# EAGLE design pc_heartypatch (EAGLE 6.4)
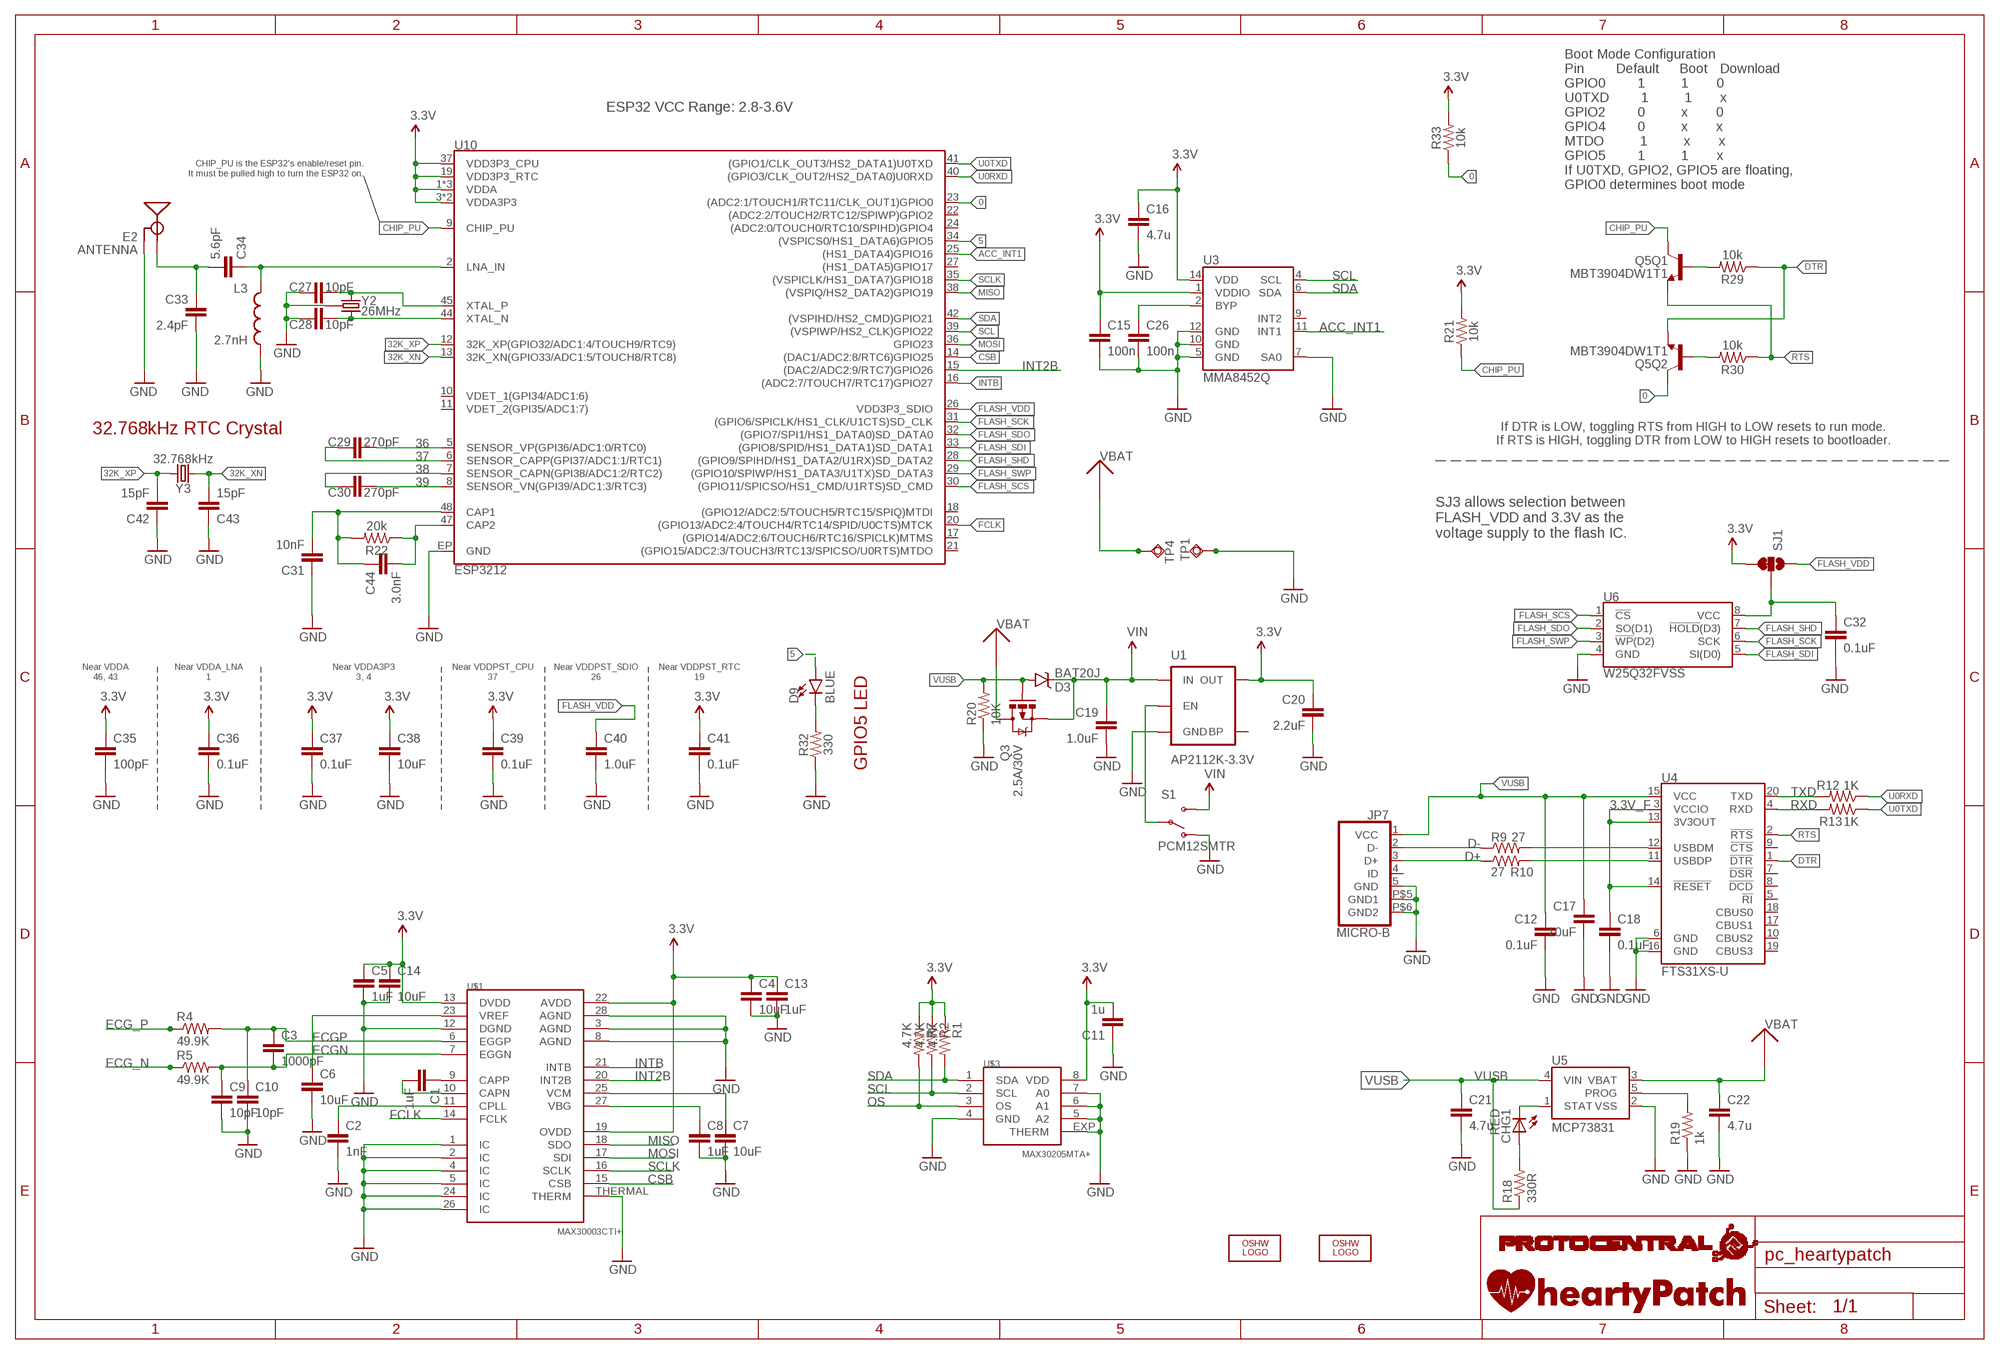
[diagram p0: schematic, sheet 1]

## Parts
C1  1uF  C-EUC0603  [C0603]
C2  1nF  C-EUC0603  [C0603]
C3  1000pF  C-EUC0402  [C0402]
C4  10uF  C-EUC0805  [C0805]
C5  1uF  C-EUC0402  [C0402]
C6  10uF  C-EUC0805  [C0805]
C7  10uF  C-EUC0805  [C0805]
C8  1uF  C-EUC0805  [C0805]
C9  10pF  C-EUC0402  [C0402]
C10  10pF  C-EUC0402  [C0402]
C11  1u  C-EUC0805  [C0805]
C12  0.1uF  C-EUC0402  [C0402]
C13  1uF  C-EUC0805  [C0805]
C14  10uF  C-EUC0603  [C0603]
C15  100n  C-EUC0402  [C0402]
C16  4.7u  C-EUC0805  [C0805]
C17  10uF  C-EUC0805  [C0805]
C18  0.1uF  C-EUC0402  [C0402]
C19  1.0uF  C-EUC0402  [C0402]
C20  2.2uF  2.2UF-10V-20%(0603)  [0603-CAP@1]
C21  4.7u  C-EUC0805  [C0805]
C22  4.7u  C-EUC0805  [C0805]
C26  100n  C-EUC0402  [C0402]
C27  10pF  10PF-0603-50V-5%  [0603]
C28  10pF  10PF-0603-50V-5%  [0603]
C29  270pF  270PF-50V-5%(0603)  [0603]
C30  270pF  270PF-50V-5%(0603)  [0603]
C31  10nF  10NF-0603-50V-10%  [0603]
C32  0.1uF  0.1UF-0402-16V-10%  [0402]
C33  2.4pF  2.4PF-0603-50V-5%  [0603]
C34  5.6pF  5.6PF-50V-5%(0603)  [0603]
C35  100pF  100PF-0603-50V-5%  [0603]
C36  0.1uF  0.1UF-0603-25V-(+80/-20%)  [0603]
C37  0.1uF  0.1UF-0603-25V-(+80/-20%)  [0603]
C38  10uF  10UF-0603-6.3V-20%  [0603]
C39  0.1uF  0.1UF-0402-16V-10%  [0402]
C40  1.0uF  1.0UF-0603-16V-10%  [0603]
C41  0.1uF  0.1UF-0603-25V-(+80/-20%)  [0603]
C42  15pF  15PF-0603-50V-5%  [0603]
C43  15pF  15PF-0603-50V-5%  [0603]
C44  3.0nF  3.0NF-0603-50V-5%  [0603]
CHG1  RED  LEDCHIPLED_0603  [CHIPLED_0603]
D3  BAT20J  DIODE-SCHOTTKY-BAT20J  [SOD-323]
D9  BLUE  LED-BLUE0603  [LED-0603]
E2  ANTENNA  ANTENNATRACE-TUNED  [TRACE_ANTENNA_2.4GHZ_25.7MM_TUNED]
JP7  MICRO-B  [MICRO-B]
L3  2.7nH  INDUCTOR0603  [0603]
LOGO1  OSHW_LOGO_FILLX0200-NT  [OSHW_FILLX200_NOTEXT]
LOGO2  OSHW_LOGO_FILLX0200-NT  [OSHW_FILLX200_NOTEXT]
Q3  2.5A/30V  MOSFET-PCHANNELDMG2307L  [SOT23-3]
Q5  MBT3904DW1T1  [SC70-6]
R1  4.7K  R-US_R0402  [R0402]
R2  4.7K  R-US_R0402  [R0402]
R4  49.9K  RESISTOR0805-RES  [0805]
R5  49.9K  RESISTOR0805-RES  [0805]
R7  4.7K  R-US_R0402  [R0402]
R9  27  R-US_R0402  [R0402]
R10  27  R-US_R0402  [R0402]
R12  1K  R-US_R0402  [R0402]
R13  1K  R-US_R0402  [R0402]
R18  330R  R-US_R0402  [R0402]
R19  1k  R-US_R0402  [R0402]
R20  10K  R-US_R0402  [R0402]
R21  10k  10KOHM-1/10W-1%(0603)0603  [0603]
R22  20k  20KOHM-0603-1/10W-1%  [0603]
R29  10k  10KOHM-0603-1/10W-1%  [0603]
R30  10k  10KOHM-0603-1/10W-1%  [0603]
R32  330  330OHM1/10W1%(0603)  [0603]
R33  10k  10KOHM-1/10W-1%(0603)0603  [0603]
S1  PCM12SMTR  SWITCH-SPDT-SMD-A  [SWITCH-SPST-SMD-A]
SJ1  JUMPER-PAD-3-2OF3_NC_BY_TRACE_SMALL  [PAD-JUMPER-3-2OF3_NC_BY_TRACE_YES_SILK_FULL_BOX]
TP1  TPSQTP20SQ  [TP20SQ]
TP4  TPSQTP20SQ  [TP20SQ]
U1  AP2112K-3.3V  V_REG_LDOSMD  [SOT23-5]
U3  MMA8452Q  [QFN-16_0.5MM]
U4  FTS31XS-U  FT231XS  [SSOP20_L]
U5  MCP73831  [SOT23-5]
U6  W25Q32FVSS  [SOIC-8]
U10  ESP3212  [QFN48-0.4MM]
U$1  MAX30003CTI+  MAX30003  [QFN-28]
U$3  MAX30205MTA+  [TDFN-08]
U$8  HEARTYPATCHHEART  [HEARTYPATCH]
U$9  PROTY_LOGO_WITH_TEXT  [PROTY_WITH_TEXT]
Y2  26MHz  CRYSTAL-GROUNDED3.2X2.5  [CRYSTAL-SMD-3.2X2.5]
Y3  32.768kHz  CRYSTAL-32.768KHZSMD-3.2X1.5  [CRYSTAL-SMD-3.2X1.5MM]

## Nets
0: Q5.6(Q2:C) R33.1 U10.23((ADC2:1/TOUCH1/RTC11/CLK_OUT1)GPIO0)
3.3V: C4.1 C5.1 C11.2 C13.1 C14.1 C15.1 C16.1 C20.1 C35.1 C36.1 C37.1 C38.1 C39.1 C41.1 R1.1 R2.1 R7.1 R21.2 R33.2 SJ1.3 U1.5(OUT) U3.1(VDDIO) U3.14(VDD) U10.1(VDDA) U10.3(VDDA3P3) U10.4(VDDA3P3) U10.19(VDD3P3_RTC) U10.37(VDD3P3_CPU) U10.43(VDDA) U10.46(VDDA) U$1.13(DVDD) U$1.19(OVDD) U$1.22(AVDD) U$3.8(VDD)
3.3V_F: C18.1 U4.3(VCCIO) U4.13(3V3OUT) U4.14(!RESET)
5: D9.A U10.34((VSPICS0/HS1_DATA6)GPIO5)
32K_XN: C43.2 U10.13(32K_XN(GPIO33/ADC1:5/TOUCH8/RTC8)) Y3.P$2
32K_XP: C42.2 U10.12(32K_XP(GPIO32/ADC1:4/TOUCH9/RTC9)) Y3.P$1
36: C29.2 U10.5(SENSOR_VP(GPI36/ADC1:0/RTC0))
37: C29.1 U10.6(SENSOR_CAPP(GPI37/ADC1:1/RTC1))
38: C30.1 U10.7(SENSOR_CAPN(GPI38/ADC1:2/RTC2))
39: C30.2 U10.8(SENSOR_VN(GPI39/ADC1:3/RTC3))
ACC_INT1: U3.11(INT1) U10.25((HS1_DATA4)GPIO16)
CAP_10N: C31.2 C44.1 R22.2 U10.48(CAP1)
CHIP_PU: Q5.3(Q1:C) R21.1 U10.9(CHIP_PU)
CSB: U10.14((DAC1/ADC2:8/RTC6)GPIO25) U$1.15(CSB)
D+: JP7.3(D+) R10.1
D-: JP7.2(D-) R9.1
DTR: Q5.1(Q2:E) R29.1 U4.1(!DTR)
ECG_N: R5.1
ECG_P: R4.1
ECGN: C3.2 C9.1 R5.2 U$1.7(EGGN)
ECGP: C3.1 C10.1 R4.2 U$1.6(EGGP)
FCLK: U10.20((GPIO13/ADC2:4/TOUCH4/RTC14/SPID/U0CTS)MTCK) U$1.14(FCLK)
FLASH_SCK: U6.6(SCK) U10.31((GPIO6/SPICLK/HS1_CLK/U1CTS)SD_CLK)
FLASH_SCS: U6.1(!CS!) U10.30((GPIO11/SPICSO/HS1_CMD/U1RTS)SD_CMD)
FLASH_SDI: U6.5(SI(D0)) U10.33((GPIO8/SPID/HS1_DATA1)SD_DATA1)
FLASH_SDO: U6.2(SO(D1)) U10.32((GPIO7/SPI1/HS1_DATA0)SD_DATA0)
FLASH_SHD: U6.7(!HOLD!(D3)) U10.28((GPIO9/SPIHD/HS1_DATA2/U1RX)SD_DATA2)
FLASH_SWP: U6.3(!WP!(D2)) U10.29((GPIO10/SPIWP/HS1_DATA3/U1TX)SD_DATA3)
FLASH_VDD: C40.1 SJ1.1 U10.26(VDD3P3_SDIO)
GND: C2.2 C4.2 C5.2 C6.2 C7.2 C8.2 C9.2 C10.2 C11.1 C12.2 C13.2 C14.2 C15.2 C16.2 C17.2 C18.2 C19.2 C20.2 C21.2 C22.2 C26.2 C27.1 C28.1 C31.1 C32.2 C33.2 C35.2 C36.2 C37.2 C38.2 C39.2 C40.2 C41.2 C42.1 C43.1 E2.GND E2.GND2(GND) JP7.5(GND) JP7.P$5(GND1) JP7.P$6(GND2) L3.2 R19.1 R20.1 R32.1 S1.1(O) TP1.TP U1.2(GND) U3.5(GND) U3.7(SA0) U3.10(GND) U3.12(GND) U4.6(GND) U4.16(GND) U5.2(VSS) U6.4(GND) U10.EP(GND) U$1.1(IC) U$1.2(IC) U$1.3(AGND) U$1.4(IC) U$1.5(IC) U$1.8(AGND) U$1.12(DGND) U$1.24(IC) U$1.26(IC) U$1.28(AGND) U$1.THERMAL(THERM) U$3.4(GND) U$3.5(A2) U$3.6(A1) U$3.7(A0) U$3.EXP(THERM) Y2.2(GND) Y2.4(GND)
INT2B: U10.15((DAC2/ADC2:9/RTC7)GPIO26) U$1.20(INT2B)
INTB: U10.16((ADC2:7/TOUCH7/RTC17)GPIO27) U$1.21(INTB)
LNA_IN: C34.1 L3.1 U10.2(LNA_IN)
MISO: U10.38((VSPIQ/HS2_DATA2)GPIO19) U$1.18(SDO)
MOSI: U10.36(GPIO23) U$1.17(SDI)
N$2: C6.1 U$1.23(VREF)
N$3: C1.1 U$1.9(CAPP)
N$4: C26.1 U3.2(BYP)
N$5: CHG1.C U5.1(STAT)
N$6: C1.2 U$1.10(CAPN)
N$7: C2.1 U$1.11(CPLL)
N$9: R9.2 U4.12(USBDM)
N$11: R10.2 U4.11(USBDP)
N$13: C7.1 U$1.25(VCM)
N$14: C8.1 U$1.27(VBG)
N$15: S1.2(P) U1.3(EN)
N$16: CHG1.A R18.2
N$19: R19.2 U5.5(PROG)
N$20: C32.1 SJ1.2 U6.8(VCC)
N$23: Q5.5(Q1:B) R29.2
N$24: Q5.2(Q2:B) R30.2
N$25: C27.2 U10.45(XTAL_P) Y2.1
N$26: C28.2 U10.44(XTAL_N) Y2.3
N$29: D9.C R32.2
N$30: C44.2 R22.1 U10.47(CAP2)
OS: R7.2 U$3.3(OS)
RTS: Q5.4(Q1:E) R30.1 U4.2(!RTS)
RXD: R13.2 U4.4(RXD)
SCL: R2.2 U3.4(SCL) U10.39((VSPIWP/HS2_CLK)GPIO22) U$3.2(SCL)
SCLK: U10.35((VSPICLK/HS1_DATA7)GPIO18) U$1.16(SCLK)
SDA: R1.2 U3.6(SDA) U10.42((VSPIHD/HS2_CMD)GPIO21) U$3.1(SDA)
TRACE_ANT1: C33.1 C34.2 E2.ANT(SIGNAL)
TXD: R12.2 U4.20(TXD)
U0RXD: R12.1 U10.40((GPIO3/CLK_OUT2/HS2_DATA0)U0RXD)
U0TXD: R13.1 U10.41((GPIO1/CLK_OUT3/HS2_DATA1)U0TXD)
VBAT: C22.1 Q3.3(D) TP4.TP U5.3(VBAT)
VIN: C19.1 D3.C Q3.2(S) S1.3(S) U1.1(IN)
VUSB: C12.1 C17.1 C21.1 D3.A JP7.1(VCC) Q3.1(G) R18.1 R20.2 U4.15(VCC) U5.4(VIN)
Unconnected: JP7.4(ID) U1.4(BP) U3.9(INT2) U4.5(!RI) U4.7(!DSR) U4.8(!DCD) U4.9(!CTS) U4.10(CBUS2) U4.17(CBUS1) U4.18(CBUS0) U4.19(CBUS3) U10.10(VDET_1(GPI34/ADC1:6)) U10.11(VDET_2(GPI35/ADC1:7)) U10.17((GPIO14/ADC2:6/TOUCH6/RTC16/SPICLK)MTMS) U10.18((GPIO12/ADC2:5/TOUCH5/RTC15/SPIQ)MTDI) U10.21((GPIO15/ADC2:3/TOUCH3/RTC13/SPICSO/U0RTS)MTDO) U10.22((ADC2:2/TOUCH2/RTC12/SPIWP)GPIO2) U10.24((ADC2:0/TOUCH0/RTC10/SPIHD)GPIO4) U10.27((HS1_DATA5)GPIO17)

## Notes on the sheet
- ESP32 VCC Range: 2.8-3.6V
- CHIP_PU is the ESP32's enable/reset pin.
  It must be pulled high to turn the ESP32 on.
- Boot Mode Configuration
  Pin        Default     Boot   Download
  GPIO0        1         1       0
  U0TXD        1         1       x
  GPIO2        0         x       0
  GPIO4        0         x       x
  MTDO         1         x       x
  GPIO5        1         1       x
  If U0TXD, GPIO2, GPIO5 are floating, 
  GPIO0 determines boot mode
- 32.768kHz RTC Crystal
- If DTR is LOW, toggling RTS from HIGH to LOW resets to run mode.
  If RTS is HIGH, toggling DTR from LOW to HIGH resets to bootloader.
- SJ3 allows selection between 
  FLASH_VDD and 3.3V as the
  voltage supply to the flash IC.
- Near VDDA
  46, 43
- Near VDDA_LNA
  1
- Near VDDA3P3
  3, 4
- Near VDDPST_CPU
  37
- Near VDDPST_SDIO
  26
- Near VDDPST_RTC
  19
- GPIO5 LED

## Library data of the parts
C1-C19 C21 C22 C26 = rcl:C-EU: CAPACITOR, European symbol
C20 = SparkFun-Capacitors:2.2UF-10V-20%(0603): CAP-07888; PROD_ID: CAP-07888
C27 C28 = SparkFun-Capacitors:10PF: 10pF ceramic capacitors A capacitor is a passive two-terminal electrical component used to store electrical energy temporarily in an electric field.; PROD_ID: CAP-11812
C29 C30 = esp32-thing-temp:270PF-50V-5%(0603): CAP-13339; PROD_ID: CAP-13339
C31 = SparkFun-Capacitors:10NF: 0.01uF/10nF/10,000pF ceramic capacitors A capacitor is a passive two-terminal electrical component used to store electrical energy temporarily in an electric field. CAP-09321; PROD_ID: CAP-00867
C32 C39 = SparkFun-Capacitors:0.1UF: 0.1µF ceramic capacitors A capacitor is a passive two-terminal electrical component used to store electrical energy temporarily in an electric field.; PROD_ID: CAP-12416
C33 = esp32-thing-temp:2.4PF: 2.4pF ceramic capacitors A capacitor is a passive two-terminal electrical component used to store electrical energy temporarily in an electric field.; PROD_ID: CAP-13541
C34 = esp32-thing-temp:5.6PF-50V-5%(0603): CAP-12456; PROD_ID: CAP-12456
C35 = SparkFun-Capacitors:100PF: 100pF/0.1nF ceramic capacitors A capacitor is a passive two-terminal electrical component used to store electrical energy temporarily in an electric field.; PROD_ID: CAP-07883
C36 C37 C41 = SparkFun-Capacitors:0.1UF: 0.1µF ceramic capacitors A capacitor is a passive two-terminal electrical component used to store electrical energy temporarily in an electric field.; PROD_ID: CAP-00810
C38 = SparkFun-Capacitors:10UF: 10.0µF ceramic capacitors A capacitor is a passive two-terminal electrical component used to store electrical energy temporarily in an electric field.; PROD_ID: CAP-11015
C40 = SparkFun-Capacitors:1.0UF: 1µF ceramic capacitors A capacitor is a passive two-terminal electrical component used to store electrical energy temporarily in an electric field.; PROD_ID: CAP-00868
C42 C43 = SparkFun-Capacitors:15PF: 15pF ceramic capacitors A capacitor is a passive two-terminal electrical component used to store electrical energy temporarily in an electric field.; PROD_ID: CAP-07881
C44 = esp32-thing-temp:3.0NF: 3.0nF (3nF, 3000pF) ceramic capacitors A capacitor is a passive two-terminal electrical component used to store electrical energy temporarily in an electric field.; PROD_ID: CAP-13515
CHG1 = led:LED: LED OSRAM: - CHIPLED LG R971, LG N971, LY N971, LG Q971, LY Q971, LO R971, LY R971 LH N974, LH R974 LS Q976, LO Q976, LY Q976 LO Q996 - Hyper CHIPLED LW Q18S LB Q993, LB Q99A, LB R99A - SideLED LS A670, LO A670, LY A670, LG A670, LP A670 LB A673, LV A673, LT A673, LW A673 LH A674 LY A675 LS A676, LA A676, LO A676, LY A676, LW A676 LS A679, LY A679, LG A679 - Hyper Micro SIDELED® LS Y876, LA Y876, LO Y876, LY Y876 LT Y87S - SmartLED LW L88C, LW L88S LB L89C, LB L89S, LG L890 LS L89K, LO L89K, LY L89K LS L896, LA L896, LO L896, LY L896 - TOPLED LS T670, LO T670, LY T670, LG T670, LP T670 LSG T670, LSP T670, LSY T670, LOP T670, LYG T670 LG T671, LOG T671, LSG T671 LB T673, LV T673, LT T673, LW T673 LH T674 LS T676, LA T676, LO T676, LY T676, LB T676, LH T676, LSB T676, LW T676 LB T67C, LV T67C, LT T67C, LS T67K, LO T67K, LY T67K, LW E67C LS E67B, LA E67B, LO E67B, LY E67B, LB E67C, LV E67C, LT E67C LW T67C LS T679, LY T679, LG T679 LS T770, LO T770, LY T770, LG T770, LP T770 LB T773, LV T773, LT T773, LW T773 LH T774 LS E675, LA E675, LY E675, LS T675 LS T776, LA T776, LO T776, LY T776, LB T776 LHGB T686 LT T68C, LB T68C - Hyper Mini TOPLED® LB M676 - Mini TOPLED Santana® LG M470 LS M47K, LO M47K, LY M47K Source: http://www.osram.convergy.de LUXEON: - LUMILED® LXK2-PW12-R00, LXK2-PW12-S00, LXK2-PW14-U00, LXK2-PW14-V00 LXK2-PM12-R00, LXK2-PM12-S00, LXK2-PM14-U00 LXK2-PE12-Q00, LXK2-PE12-R00, LXK2-PE12-S00, LXK2-PE14-T00, LXK2-PE14-U00 LXK2-PB12-K00, LXK2-PB12-L00, LXK2-PB12-M00, LXK2-PB14-N00, LXK2-PB14-P00, LXK2-PB14-Q00 LXK2-PR12-L00, LXK2-PR12-M00, LXK2-PR14-Q00, LXK2-PR14-R00 LXK2-PD12-Q00, LXK2-PD12-R00, LXK2-PD12-S00 LXK2-PH12-R00, LXK2-PH12-S00 LXK2-PL12-P00, LXK2-PL12-Q00, LXK2-PL12-R00 Source: www.luxeon.com KINGBRIGHT: KA-3528ASYC Source: www.kingbright.com
D3 = SparkFun-DiscreteSemi:DIODE-SCHOTTKY: Schottky diodes in SFE's production catalog BAT20J 1A 23V 0.62Vf RB751 120mA 40V 0.37Vf PMEG4005EJ 0.5A 40V 0.42Vf MBRA140 1A 40V 0.5Vf B340A 3A 40V SMA; PROD_ID: DIO-11623
D9 = SparkFun-LED:LED-BLUE: Blue SMD LED Used in manufacturing of various products at SparkFun 0603 - SMD 0603 package Manufacturer: Rohm Semiconductor Forward Voltage: 2.9V Forward Current: 5mA Wavelength: 470nm Digikey: [Product Link] <http://www.digikey.com/product-detail/en/SMLE12BC7TT86/511-1589-2-ND/1641808> 1206 - SMD1206 package Manufacturer:Lite-On Inc. Forward Voltage: 3.3V Forward Current: 20mA Wavelength: 468nm Digikey: [Product Link] <http://www.digikey.com/product-detail/en/lite-on-inc/LTST-C150TBKT/160-1643-1-ND/573584>; PROD_ID: DIO-08575
E2 = esp32-thing-temp:ANTENNA: Chip antenna Chip antenna with ground or secondary connection. Common with larger metal RF connectors.
JP7 = circuitects:MICRO-B
L3 = SparkFun-Passives:INDUCTOR: Inductors Basic Inductor/Choke - 0603 and 1206. Footprints are not proven and vary greatly between part numbers. INDUCTOR POWER 3.3UH 4.0A SMD 0.197" L x 0.197" W x 0.177" H (5.00mm x 5.00mm x 4.50mm); PROD_ID: NDUC-08762
LOGO1 LOGO2 = ohw-logo:OSHW_LOGO_FILL
Q3 = SparkFun-DiscreteSemi:MOSFET-PCHANNEL: Generic PMOSFET IRLML2244 - TRANS-11153 (SOT-23 -20V -4.3A) (1.Gate 2.Source 3.Drain) FQP27P06 - COM-10349 <http://www.sparkfun.com/products/10349> (TO-220 -60V -27A) (1.Gate 2.Source 3.Drain); PROD_ID: TRANS-11308
Q5 = esp32-thing-temp:MBT3904DW1T1: MBT3904DW1 Dual NPN Transistors The MBT3904W1 puts two general purpose 3904 NPN transistors in a single package. Datasheet <http://www.onsemi.com/pub_link/Collateral/MBT3904DW1T1-D.PDF>; PROD_ID: TRANS-13337
R1 R2 R7 R9 R10 R12 R13 R18-R20 = rcl:R-US_: RESISTOR, American symbol
R4 R5 = SparkFun:RESISTOR: Resistor Basic schematic elements and footprints for 0603, 1206, and PTH resistors.
R21 R33 = SparkFun-Resistors:10KOHM-1/10W-1%(0603): RES-00824; PROD_ID: RES-00824; VALUE: 10K
R22 = SparkFun-Resistors:20KOHM: 20kΩ resistor A resistor is a passive two-terminal electrical component that implements electrical resistance as a circuit element. Resistors act to reduce current flow, and, at the same time, act to lower voltage levels within circuits. - Wikipedia; PROD_ID: RES-09383
R29 R30 = SparkFun-Resistors:10KOHM: 10kΩ resistor A resistor is a passive two-terminal electrical component that implements electrical resistance as a circuit element. Resistors act to reduce current flow, and, at the same time, act to lower voltage levels within circuits. - Wikipedia; PROD_ID: RES-00824
R32 = SparkFun-Resistors:330OHM1/10W1%(0603): RES-00818; PROD_ID: RES-00818
S1 = SparkFun-Electromechanical:SWITCH-SPDT: SPDT Switch Simple slide switch, Spark Fun Electronics SKU : COM-00102 DPDT SMT slide switch, AYZ0202, SWCH-08179; PROD_ID: SWCH-10651
SJ1 = SparkFun-Passives:JUMPER-PAD-3-2OF3_NC_BY_TRACE
TP1 TP4 = testpad:TPSQ: Test pad
U1 = SparkFun-PowerIC:V_REG_LDO: Voltage Regulator LDO Standard 150mA LDO voltage regulator in SOT-23 layout. Micrel part MIC5205. BP (by-pass) pin is used to lower output noise with 470pF cap.; PROD_ID: VREG-12457
U3 = SparkFun:MMA8452Q: MMA8452Q 3-Axis, 12/8-bit Digital Accelerometer Supply Voltage: 1.6-3.6V Range: +/- 2g, 4g, 8g Interface: I2C, 12-bit and 8-bit ODR: 1.56 Hz - 800 Hz Package: QFN-16 http://cache.freescale.com/files/sensors/doc/data_sheet/MMA8452Q.pdf
U4 = SparkFun-DigitalIC:FT231X: FTDI FT231X Full Speed USB to Full-handshake UART This USB2.0 Full Speed IC offers a compact bridge to full handshake UART interfaces. The device is a UART, capable of operating up to 3MBaud, with low power consumption (8mA). The FT231X includes the complete FT-X series feature set and enables USB to be added into a system design quickly and easily over a UART interface.; PROD_ID: IC-11524; VALUE: FT231XS
U5 = SparkFun:MCP73831: Microchip's MCP73831 Miniature single cell, fully integrated Li-Ion, Li-polymer charge management controller http://ww1.microchip.com/downloads/en/DeviceDoc/21984a.pdf
U6 = SparkFun-DigitalIC:W25Q32FV: Winbond W25Q32FV 32Mbit (4MB) Flash The W25Q32FV support the standard Serial Peripheral Interface (SPI), Dual/Quad I/O SPI as well as 2-clocks instruction cycle Quad Peripheral Interface (QPI). Datasheet <http://www.winbond.com/resource-files/w25q32fv%20revh%20091613.pdf>; PROD_ID: IC-13229
U10 = esp32-thing-temp:ESP3212; PROD_ID: IC-13338
U$1 = circuitects:MAX30003
U$3 = circuitects:MAX30205
U$8 = circuitects:HEARTYPATCH
U$9 = circuitects:PROTY_LOGO_WITH_TEXT
Y2 = things:CRYSTAL-GROUNDED; PROD_ID: XTAL-12454
Y3 = SparkFun-Clocks:CRYSTAL-32.768KHZ: 32.768kHz Crystal Frequency: 32.768kHz Frequency Stability: ±20ppm Load Capacitance: 12.5pF (PTH-2X6 & SMD-3.2X1.5), 6pF (SMD-2X6); PROD_ID: XTAL-13062

## Net classes
2 gnd: width 0.254 mm, drill 0.254 mm, clearance 0.178 mm

## Board
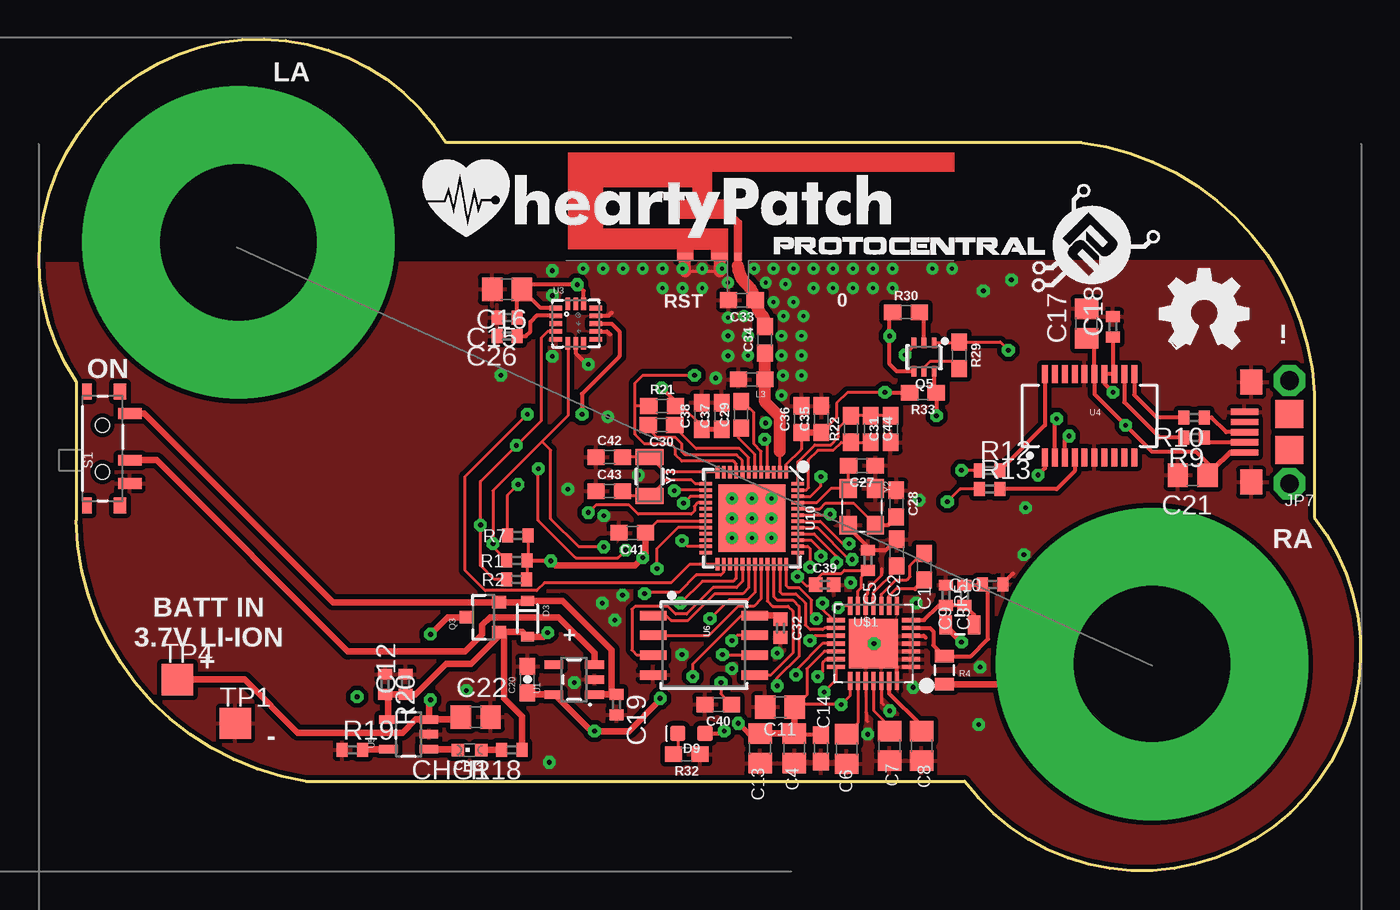
[diagram p1: board, top side]
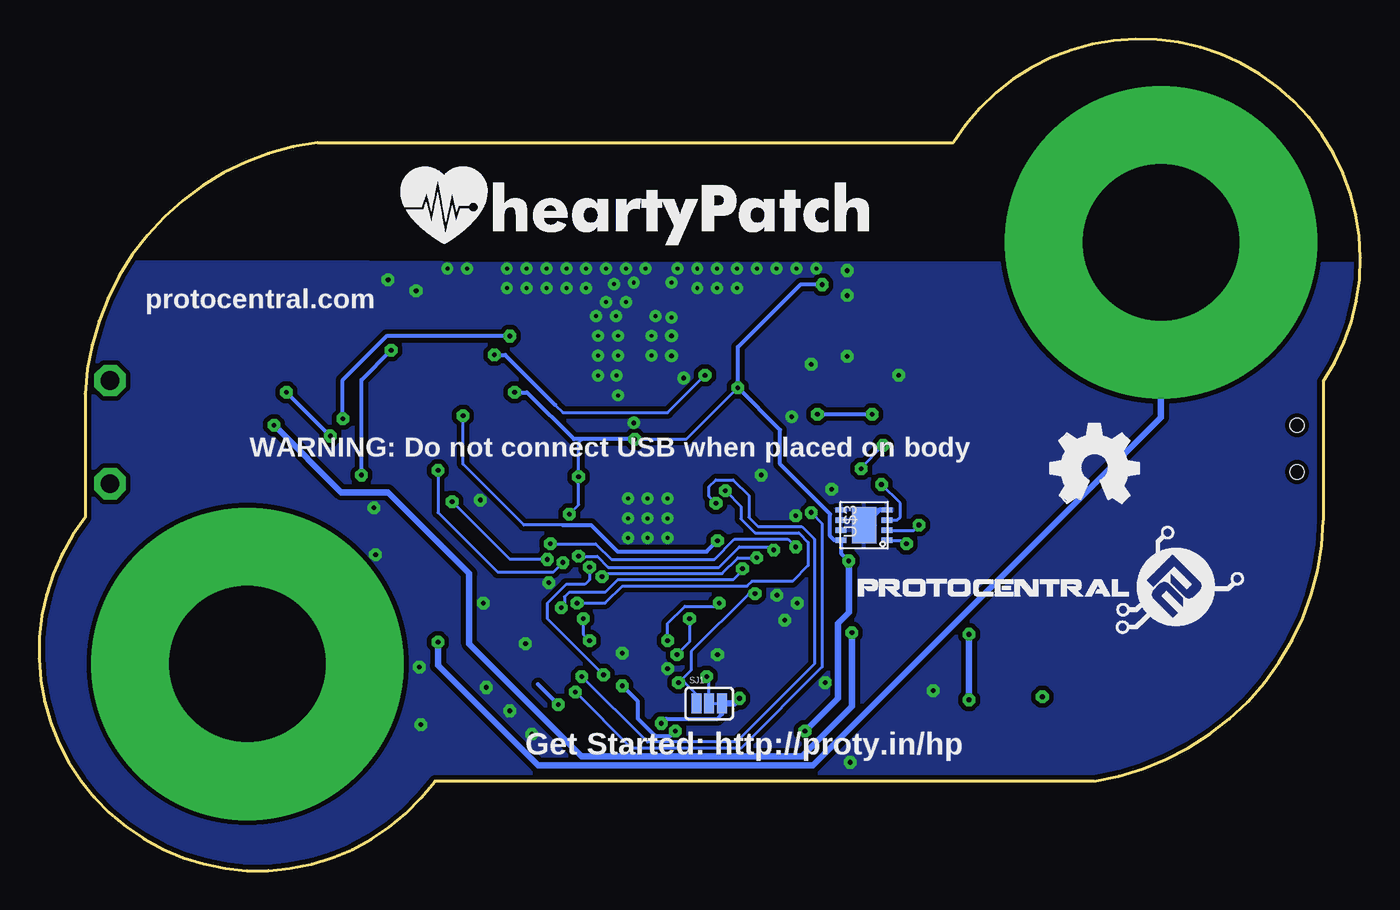
[diagram p2: board, bottom side, seen from below]

Size 84.62 x 53.26 mm. Coordinates in mm from the lower left corner, seen from the top.
Outline: 17.07,5.73 59.27,5.73 arc182 81.67,22.63 81.67,30.53 arc80 66.77,46.63 26.07,46.63 arc182 2.37,31.33 2.37,22.43 arc80 17.07,5.73
Copper layers (1*2*15*16): Top 0.035mm / dielectric 1.5mm / Route2 0.035mm / dielectric 0.15mm / Route15 0.035mm / dielectric 0.2mm / Bottom 0.035mm
Design rules "Circuitects-Rules": minimum track width 6mil, minimum drill 0.3mm, track to track 6mil, track to pad 6mil, pad to pad 6mil, via to via 6mil, smd to smd 6mil, copper to edge 10mil, drill to drill 8mil, minimum pad ring 12mil, minimum via ring 10mil, stop-mask expansion 4mil, vias tented up to drill 25mil, thermal gap 10mil

### Footprints (pad centres in the part's own frame; a part is rotated, then mirrored left to right if it is on the bottom)
C0603 = smd 1.1 x 1: 1 -0.85,0; 2 0.85,0
C0402 = smd 0.7 x 0.9: 1 -0.65,0; 2 0.65,0
C0805 = smd 1.3 x 1.5: 1 -0.95,0; 2 0.95,0
0603-CAP@1 = smd 1.1 x 1: 1 -0.85,0; 2 0.85,0
0603 = smd 1.1 x 1: 1 -0.85,0; 2 0.85,0
0402 = smd 0.85 x 0.9: 1 -0.58,0; 2 0.58,0
CHIPLED_0603 = smd 0.8 x 0.8: A 0,-0.75; C 0,0.75
SOD-323 = smd 0.63 x 0.83: A 1.15,0; C -1.15,0
LED-0603 = smd 1 x 1: A 0,-0.877; C 0,0.877
TRACE_ANTENNA_2.4GHZ_25.7MM_TUNED = smd 0.46 x 0.46: ANT 0,0.23 | smd 1 x 0.46: GND -1.18,0.23; GND2 -3.38,0.23
MICRO-B = smd 0.4 x 1.75: 1 -1.25,2.975; 2 -0.6,2.975; 3 0.05,2.975; 4 0.7,2.975; 5 1.35,2.975 | smd 1.8 x 1.8: P$1 -1.1,0.1; P$2 1.2,0.1 | drill 1.2 pad 2 octagon: P$3 -3.25,0.1; P$4 3.35,0.1 | smd 1.6 x 1.4: P$5 -3.15,2.55; P$6 3.25,2.55
SOT23-3 = smd 0.8 x 0.9: 1 -0.95,-1; 2 0.95,-1; 3 0,1.1
SC70-6 = smd 0.3 x 0.66: 1 -0.65,-0.92; 2 0,-0.92; 3 0.65,-0.92; 4 0.65,0.92; 5 0,0.92; 6 -0.65,0.92
R0402 = smd 0.7 x 0.9: 1 -0.65,0; 2 0.65,0
0805 = smd 0.8 x 1.2: 1 -0.9,0; 2 0.9,0
SWITCH-SPST-SMD-A = smd 0.7 x 1.5: 1 -2.25,-1.75; 2 -0.75,-1.75; 3 2.25,-1.75 | smd 1 x 0.6: GND1 -3.65,1; GND3 3.65,1 | smd 1 x 0.8: GND2 -3.65,-1.1; GND4 3.65,-1.1 | hole 0.9: -1.5,0; 1.5,0
PAD-JUMPER-3-2OF3_NC_BY_TRACE_YES_SILK_FULL_BOX = smd 0.635 x 1.27: 1 -0.813,0; 2 0,0; 3 0.813,0
TP20SQ = smd 2 x 2: TP 0,0
SOT23-5 = smd 0.55 x 1.2: 1 -0.95,-1.3; 2 0,-1.3; 3 0.95,-1.3; 4 0.95,1.3; 5 -0.95,1.3
QFN-16_0.5MM = smd 0.8 x 0.3: 1 -1.275,1; 2 -1.275,0.5; 3 -1.275,0; 4 -1.275,-0.5; 5 -1.275,-1; 9 1.275,-1; 10 1.275,-0.5; 11 1.275,0; 12 1.275,0.5; 13 1.275,1 | smd 0.3 x 0.8: 6 -0.5,-1.275; 7 0,-1.275; 8 0.5,-1.275; 14 0.5,1.275; 15 0,1.275; 16 -0.5,1.275
SSOP20_L = smd 0.381 x 1.143: 1 -2.857,-2.68; 2 -2.223,-2.68; 3 -1.587,-2.68; 4 -0.953,-2.68; 5 -0.318,-2.68; 6 0.318,-2.68; 7 0.953,-2.68; 8 1.587,-2.68; 9 2.223,-2.68; 10 2.857,-2.68; 11 2.857,2.68; 12 2.223,2.68; 13 1.587,2.68; 14 0.953,2.68; 15 0.318,2.68; 16 -0.318,2.68; 17 -0.953,2.68; 18 -1.587,2.68; 19 -2.223,2.68; 20 -2.857,2.68
SOIC-8 = smd 0.61 x 1.702: 1 -1.905,-3.251; 2 -0.635,-3.251; 3 0.635,-3.251; 4 1.905,-3.251; 5 1.905,3.251; 6 0.635,3.251; 7 -0.635,3.251; 8 -1.905,3.251
QFN48-0.4MM = smd 0.8 x 0.23: 1 -2.95,2.2; 2 -2.95,1.8; 3 -2.95,1.4; 4 -2.95,1; 5 -2.95,0.6; 6 -2.95,0.2; 7 -2.95,-0.2; 8 -2.95,-0.6; 9 -2.95,-1; 10 -2.95,-1.4; 11 -2.95,-1.8; 12 -2.95,-2.2; 25 2.95,-2.2; 26 2.95,-1.8; 27 2.95,-1.4; 28 2.95,-1; 29 2.95,-0.6; 30 2.95,-0.2; 31 2.95,0.2; 32 2.95,0.6; 33 2.95,1; 34 2.95,1.4; 35 2.95,1.8; 36 2.95,2.2 | smd 0.23 x 0.8: 13 -2.2,-2.95; 14 -1.8,-2.95; 15 -1.4,-2.95; 16 -1,-2.95; 17 -0.6,-2.95; 18 -0.2,-2.95; 19 0.2,-2.95; 20 0.6,-2.95; 21 1,-2.95; 22 1.4,-2.95; 23 1.8,-2.95; 24 2.2,-2.95; 37 2.2,2.95; 38 1.8,2.95; 39 1.4,2.95; 40 1,2.95; 41 0.6,2.95; 42 0.2,2.95; 43 -0.2,2.95; 44 -0.6,2.95; 45 -1,2.95; 46 -1.4,2.95; 47 -1.8,2.95; 48 -2.2,2.95 | smd 4.3 x 4.3: EP 0,0
QFN-28 = smd 1.15 x 0.27: 1 -2.4,1.5; 2 -2.4,1; 3 -2.4,0.5; 4 -2.4,0; 5 -2.4,-0.5; 6 -2.4,-1; 7 -2.4,-1.5; 15 2.4,-1.5; 16 2.4,-1; 17 2.4,-0.5; 18 2.4,0; 19 2.4,0.5; 20 2.4,1; 21 2.4,1.5 | smd 0.27 x 1.15: 8 -1.5,-2.4; 9 -1,-2.4; 10 -0.5,-2.4; 11 0,-2.4; 12 0.5,-2.4; 13 1,-2.4; 14 1.5,-2.4; 22 1.5,2.4; 23 1,2.4; 24 0.5,2.4; 25 0,2.4; 26 -0.5,2.4; 27 -1,2.4; 28 -1.5,2.4 | smd 3.15 x 3.15: THERMAL 0,0
TDFN-08 = smd 0.7 x 0.35: 1 -1.475,0.975; 2 -1.475,0.325; 3 -1.475,-0.325; 4 -1.475,-0.975; 5 1.475,-0.975; 6 1.475,-0.325; 7 1.475,0.325; 8 1.475,0.975 | smd 1.58 x 2.35: EXP 0,0
CRYSTAL-SMD-3.2X2.5 = smd 1.2 x 1.1: 1 -1.175,-0.875; 2 1.175,-0.875; 3 1.175,0.875; 4 -1.175,0.875
CRYSTAL-SMD-3.2X1.5MM = smd 1 x 1.8: P$1 -1.25,0; P$2 1.25,0

### Placement (x,y rotation side)
C1  56.68,19.47 90 top
C2  54.93,20.37 90 top
C3  59.27,17.63 270 top
C4  48.37,7.83 270 top
C5  53.08,19.87 90 top
C6  51.71,7.79 270 top
C7  54.46,7.99 270 top
C8  56.51,7.99 270 top
C9  58.07,17.63 90 top
C10  61.07,18.33 0 top
C11  47.45,10.47 0 top
C12  23.47,11.93 90 top
C13  46.17,7.83 270 top
C14  50.07,7.83 270 top
C15  29.97,35.43 180 top
C16  29.97,37.23 180 top
C17  67.07,35.03 90 top
C18  68.77,34.83 90 top
C19  36.97,10.63 270 top
C20  31.27,12.23 90 top
C21  73.87,25.33 180 top
C22  27.97,9.83 0 top
C26  29.97,34.23 180 top
C27  52.69,25.94 180 top
C28  54.9,23.51 270 top
C29  44.96,29.2 90 top
C30  39.86,28.54 180 top
C31  54.53,28.28 90 top
C32  47.47,15.52 270 top
C33  45.01,36.54 180 top
C34  46.48,34 90 top
C35  50.09,28.92 90 top
C36  48.82,28.92 90 top
C37  43.71,29.12 90 top
C38  42.44,29.12 90 top
C39  50.31,18.31 0 top
C40  43.5,10.64 180 top
C41  37.99,21.63 180 top
C42  36.52,26.48 0 top
C43  36.52,24.3 0 top
C44  53.26,28.28 270 top
CHG1  27.57,7.73 90 top
D3  31.27,16.13 270 top
D9  41.78,8.78 90 top
E2  44.75,39.08 0 top
JP7  80.17,28.03 90 top
L3  45.64,31.46 180 top
LOGO1  71.77,33.43 0 top
LOGO2  19.87,23.53 0 bottom
Q3  28.47,16.23 90 top
Q5  56.67,32.89 180 top
R1  30.6,19.86 180 top
R2  30.58,18.66 180 top
R4  57.97,12.83 90 top
R5  58.97,15.73 0 top
R7  30.66,21.46 180 top
R9  73.97,27.73 180 top
R10  73.97,29.03 180 top
R12  60.87,25.63 0 top
R13  60.87,24.43 0 top
R18  30.27,7.73 180 top
R19  20.07,7.73 0 top
R20  22.17,11.93 270 top
R21  39.9,29.75 0 top
R22  51.99,28.28 90 top
R29  58.92,33 270 top
R30  55.52,35.76 0 top
R32  41.47,7.45 180 top
R33  56.6,30.6 180 top
S1  4.07,27.03 90 top
SJ1  41.7,10.7 0 bottom
TP1  12.57,9.43 0 top
TP4  8.87,12.23 0 top
U1  34.27,12.23 90 top
U3  34.37,35.03 0 top
U4  67.27,29.13 0 top
U5  23.67,8.73 90 top
U6  42.58,14.43 270 top
U10  45.64,22.57 270 top
U$1  53.44,14.54 180 top
U$3  31.79,22.12 180 bottom
U$4  HEARTYPATCHHEART  [HEARTYPATCH]  61.47,40.08 0 bottom
U$7  PROTY_LOGO_WITH_TEXT  [PROTY_WITH_TEXT]  47.07,37.43 0 top
U$8  24.57,40.53 0 top
U$9  32.17,15.53 0 bottom
Y2  52.69,23.3 270 top
Y3  39.09,25.24 270 top

### Tracks (layer width: path | path; a pad name or v marks a point on that pad's centre or on a via)
0  (via drill 0.3)
  Top 0.2: U10.23 41.53,20.77 v41.17,21.13
  Top 0.254: Q5.6 57.32,30.73 R33.1 57.45,29.15 v57.47,29.13
  Bottom 0.2: 51.07,22.13 53.57,22.13 57.47,26.03 v57.47,29.13
  Bottom 0.254: v41.17,21.13 41.87,20.43 47.57,20.43 49.27,22.13 51.07,22.13
3.3V  (via drill 0.3)
  Top 0.2: U10.1 47.84,26.01 48.82,26.98 C36.1 | U10.3 U10.4 46.64,27.46 v46.47,27.63 | R21.2 41.15,29.75 42.44,28.46 C38.1 | U10.37 48.59,18.86 v48.57,18.83 49.19,18.21 C39.1 49.73,18.59 50.17,19.03 51.37,19.03 51.57,19.23 C5.1 52.67,18.81 52.67,18.13 52.44,17.9 U$1.13 | U$1.22 51.94,11.2 v51.37,10.63 48.06,10.63 C11.2 49.17,11.24 49.17,12.93 50.28,14.04 U$1.19 | 38.94,21.73 C41.1 39.58,22.37 U10.19 | U10.43 50.63,22.77 v50.67,22.83 | C35.1 50.1,28.07 51.07,29.03 51.07,29.93 51.77,30.63 v54.17,30.63 | U10.46 49.4,23.97 50.07,24.63 v50.07,25.23 | R2.1 31.25,18.78 R1.1 31.31,19.92 R7.1
  Top 0.254: C16.1 32.12,36.03 U3.1 | C15.1 30.62,36.93 C16.1 | C16.1 31.22,37.53 v34.47,37.53 34.87,37.13 U3.14 | R21.2 40.75,30.05 v39.87,30.93 | R33.2 54.2,30.6 v54.17,30.63 | R1.1 32.74,19.86 v32.77,19.83 | C14.1 48.47,8.68 C4.1
  Top 0.305: C38.1 C37.1 | C13.1 45.42,8.78 v44.77,9.43
  Top 0.406: C36.1 C35.1 | C13.1 C4.1 48.37,10.54 C11.2 | C20.1 31.37,11.28 U1.5 33.02,11.28 35.37,8.93 v35.57,8.93 37.77,8.93 39.77,10.93 v39.77,11.03 | C41.1 38.84,20.21 v38.67,20.03 38.17,19.53 33.07,19.53 v32.77,19.83
  Bottom 0.2: v46.47,27.63 43.17,27.63 v39.87,30.93 | v50.67,22.83 50.07,23.43 v50.07,25.23 50.07,27.43 49.87,27.63 | v38.67,20.03 39.87,20.03 40.87,19.03 48.37,19.03 v48.57,18.83
  Bottom 0.254: 52.67,11.93 v51.37,10.63 | v34.47,37.53 35.87,37.53 39.87,33.53 v39.87,30.93 37.17,28.23 37.17,26.03 33.97,22.83 33.97,21.43 33.68,21.15 U$3.8 33.26,20.33 v32.77,19.83 | v54.17,30.63 53.37,30.63 50.37,27.63 49.87,27.63 v46.47,27.63 | 44.57,9.63 44.47,9.73 41.17,9.73 40.87,10.03 40.87,10.68 SJ1.3
  Bottom 0.305: 44.57,9.63 v44.77,9.43
  Bottom 0.406: SJ1.3 40.1,10.7 v39.77,11.03 | v32.77,19.83 32.77,16.53 33.47,15.83 33.47,11.03 v35.57,8.93
3.3V_F  (via drill 0.3)
  Top 0.254: v68.77,30.63 68.22,31.18 U4.14 U4.13 68.77,31.9 C18.1 | U4.3 65.68,27.54 v65.97,27.83
  Bottom 0.254: v68.77,30.63 v65.97,27.83
5  (via drill 0.3)
  Top 0.2: U10.34 47.04,17.56 47.27,17.33 48.27,17.33 48.67,16.93 48.67,13.73 47.27,12.33 v47.27,11.83
  Top 0.254: D9.A 43.71,8.78 v43.87,8.93
  Bottom 0.254: v47.27,11.83 46.27,10.83 46.27,9.73 45.17,8.63 44.17,8.63 v43.87,8.93
32K_XN
  Top 0.2: C43.2 37.68,23.99 Y3.P$2 40.13,25.03 41.77,25.03 42.03,24.77 U10.13
32K_XP
  Top 0.2: U10.12 40.07,25.52 Y3.P$1 37.68,26.49 C42.2
36
  Top 0.2: 44.85,29.95 C29.2 45.05,30.05 45.77,29.33 45.77,27.33 46.24,26.86 U10.5
37
  Top 0.2: U10.6 45.84,26.66 44.76,27.74 C29.1
38
  Top 0.2: U10.7 45.44,26.46 44.87,27.03 42.07,27.03 40.81,28.29 C30.1
39
  Top 0.2: U10.8 45.04,26.26 44.67,26.63 41.37,26.63 41.17,26.83 41.17,27.33 40.77,27.73 39.57,27.73 39.11,28.19 C30.2
ACC_INT1  (via drill 0.3)
  Top 0.2: U10.25 41.65,19.62 40.47,18.43 32.37,18.43 31.87,17.93 28.57,17.93 27.27,19.23 27.27,25.23 v31.27,29.23
  Top 0.254: U3.11 36.67,35.03 37.17,34.53 37.17,32.93 34.77,30.53 v34.77,29.23
  Bottom 0.254: v34.77,29.23 v31.27,29.23
CAP_10N
  Top 0.178: C31.2 C44.1 R22.2 51.21,28.34 51.21,27.77 50.7,27.26 49.68,27.26 48.59,26.18 U10.48
CHIP_PU  (via drill 0.3)
  Top 0.2: U10.9 44.64,26.06 44.47,26.23 41.17,26.23 40.77,26.63 40.77,27.03 40.47,27.33 38.77,27.33 38.17,27.93 38.17,29.73 | 38.17,29.73 38.17,31.23 38.67,31.73 v41.97,31.73 | R21.1 38.19,29.75 38.17,29.73 | Q5.3 56.02,33.58 v55.47,33.03
  Bottom 0.2: 51.57,29.83 51.07,29.33 44.37,29.33 v41.97,31.73
  Bottom 0.254: v55.47,33.03 54.77,33.03 51.57,29.83
CSB  (via drill 0.3)
  Top 0.2: U$1.15 50.86,16.04 50.17,16.73 v50.17,17.13 | U10.14 40.7,24.37 v40.67,24.33
  Bottom 0.2: v50.17,17.13 48.37,17.13 47.27,18.23 39.27,18.23 38.97,18.53 36.37,18.53 35.37,19.53 35.37,21.03 35.97,21.63 38.77,21.63 39.67,22.53 39.67,23.33 v40.67,24.33
D+
  Top 0.254: JP7.3 76.02,28.08 75.07,29.03 R10.1
D-
  Top 0.254: JP7.2 74.92,27.43 R9.1
DTR  (via drill 0.3)
  Top 0.2: v62.07,33.33 61.55,33.85 R29.1 58.88,33.81 Q5.1
  Top 0.254: U4.1 64.41,25.77 v63.97,25.33
  Bottom 0.254: v63.97,25.33 63.97,31.43 v62.07,33.33
ECG_N  (via drill 0.3, 10 pad 20)
  Top 0.406: R5.1 58.17,15.73 58.17,15.53 v59.07,14.63
  Bottom 0.406: v59.07,14.63 59.07,13.13 52.67,6.73 35.07,6.73 12.77,29.03 v12.77,40.23
ECG_P  (via drill 10 pad 20)
  Top 0.406: R4.1 69.97,11.93 v71.27,13.23
ECGN
  Top 0.254: U$1.7 56.68,16.04 57.62,16.98 C9.1 C3.2 59.87,16.38 R5.2
ECGP
  Top 0.254: U$1.6 57.06,15.54 57.27,15.33 57.27,14.43 R4.2 59.67,13.73 60.77,14.83 60.77,17.98 C10.1 | C3.1 60.37,18.28 C10.1 | 60.47,18.28 C10.1
FCLK  (via drill 0.3)
  Top 0.2: v39.57,19.33 39.57,20.63 40.9,21.97 U10.20 | U$1.14 51.28,16.94 v51.17,16.83
  Bottom 0.2: v39.57,19.33 39.57,19.23 40.17,18.63 47.57,18.63 48.37,17.83 50.67,17.83 50.97,17.53 50.97,17.03 v51.17,16.83
FLASH_SCK  (via drill 0.3)
  Top 0.2: U10.31 45.84,17.81 45.37,17.33 44.17,17.33 v42.97,16.13 | U6.6 44.2,13.8 v43.77,13.83
  Bottom 0.2: v42.97,16.13 42.97,14.63 v43.77,13.83
FLASH_SCS
  Top 0.2: U10.30 45.44,18.11 45.07,17.73 43.27,17.73 41.57,16.03 40.47,16.03 40.16,16.34 U6.1
FLASH_SDI
  Top 0.2: U10.33 46.64,17.26 46.97,16.93 47.97,16.93 48.27,16.63 48.27,13.93 46.86,12.53 U6.5
FLASH_SDO
  Top 0.2: U10.32 46.24,17.41 45.77,16.93 44.77,16.93 42.9,15.07 U6.2
FLASH_SHD  (via drill 0.3)
  Top 0.2: U10.28 44.64,18.71 44.47,18.53 42.47,18.53 v41.07,17.13 | U6.7 44.7,15.07 v44.37,14.73
  Bottom 0.2: v44.37,14.73 44.37,15.83 43.27,16.93 41.27,16.93 v41.07,17.13
FLASH_SWP
  Top 0.2: U10.29 45.04,18.51 44.67,18.13 43.17,18.13 41.47,16.43 40.77,16.43 40.27,16.93 38.17,16.93 37.97,16.73 37.97,14.13 38.3,13.8 U6.3
FLASH_VDD  (via drill 0.3)
  Top 0.2: U10.26 43.84,19.11 43.67,18.93 42.07,18.93 40.97,17.83 38.87,17.83 v38.77,17.73 | v43.67,12.03 43.67,11.32 C40.1
  Bottom 0.2: SJ1.1 42.52,11.28 43.27,12.03 v43.67,12.03 42.87,12.83 42.87,14.03 39.17,17.73 v38.77,17.73
GND  (via drill 0.25, 0.3)
  Top 0.178: 43.57,38.36 41.37,38.36
  Top 0.2: U$1.24 52.94,10.16 52.97,10.13 52.97,9.63 53.07,9.53 | U$1.26 53.94,10.76 54.07,10.63 | U$1.12 52.94,17.6 53.07,17.73 53.07,18.03 53.97,18.93 53.97,19.33
  Top 0.254: 52.94,14.04 U$1.THERMAL | U$1.28 54.94,13.04 53.94,14.04 | U3.7 34.37,33.13 35.07,32.43 v35.17,32.43 | U3.10 36.37,34.53 36.57,34.33 | U3.12 36.47,35.53 36.67,35.73 | U$1.5 56.66,15.04 56.77,14.93 | Y2.2 51.82,21.98 53.08,20.72 C5.2 54.23,20.52 C2.2 | C10.2 61.72,18.38 62.37,19.03
  Top 0.762: E2.GND 43.57,38.36 | 41.37,38.36 E2.GND2
  Bottom 0.305: U$3.4 30.81,23.1 U$3.EXP
  other vias: 60.17,9.34 44.37,22.57 44.37,23.84 45.64,23.84 46.91,22.57 46.91,21.3 45.64,21.3 44.37,21.3 41.2,38.57 39.93,38.57 38.66,38.57 37.39,38.57 36.12,38.57 34.85,38.57 42.47,38.57 43.74,38.57 45.77,38.57 47.04,38.57 48.31,38.57 49.58,38.57 50.85,38.57 52.12,38.57 53.39,38.57 54.66,38.57 57.2,38.57 58.47,38.57 44.12,37.65 46.53,37.65 45.14,35.52 47.68,35.52 47.04,36.41 45.39,34.25 47.55,34.25 45.39,32.98 47.55,32.98 47.65,31.71 47.55,30.44 46.52,28.67 44.12,34.25 44.12,32.98 44.12,35.42 42.47,37.3 41.2,37.3 39.93,37.3 47.8,37.55 48.31,36.41 48.95,35.52 48.82,34.25 48.82,32.98 48.82,31.71 49.58,37.3 50.85,37.3 52.12,37.3 53.39,37.3 54.66,37.3 45.64,22.57 36.42,29.06 43.34,31.55 36.87,16.03 32.87,32.93 32.87,38.43 29.57,31.73 41.17,13.83 56.17,17.13 56.37,23.73 63.07,20.23 63.17,23.23 47.27,13.93 37.37,17.63 33.87,24.43 36.07,17.13 36.17,22.73 60.27,13.03 51.97,18.43 53.47,14.53 44.37,12.93 60.47,37.13 62.27,37.83 32.87,36.83 27.37,11.53 32.67,6.93 34.27,12.03 54.47,10.23 55.97,11.73 53.07,8.73 46.91,23.84 38.37,25.33
  pour Bottom (isolate 0.305, rank 6): 86.17,-0.27 -4.63,-0.37 -4.63,38.86 86.17,38.96
  pour Top (isolate 0.305, rank 6): -4.63,-0.37 86.17,-0.27 86.17,38.96 59.79,38.96 59.77,38.93 59.67,38.93 59.64,38.96 59.39,38.96 59.37,38.93 -4.63,38.86
INT2B  (via drill 0.3)
  Top 0.2: U$1.20 50.38,13.54 50.17,13.33 50.17,12.73 v49.87,12.43 | U10.15 41.7,23.97 v41.27,23.53
  Bottom 0.2: v41.27,23.53 41.7,23.97 41.7,24.6 41.27,25.03 40.17,25.03 39.17,24.03 39.17,22.63 38.57,22.03 35.77,22.03 34.97,21.23 34.97,13.23 39.97,8.23 45.67,8.23 v49.87,12.43
INTB  (via drill 0.3)
  Top 0.2: U$1.21 51.04,12.2 v50.27,11.43 | U10.16 42.2,23.57 41.97,23.33 41.97,23.03 41.77,22.83 38.37,22.83 37.77,23.43 35.67,23.43 v35.17,22.93
  Bottom 0.2: v50.27,11.43 46.67,7.83 39.67,7.83 34.47,13.03 34.47,22.23 v35.17,22.93
LNA_IN
  Top 0.178: L3.1 46.48,31.47 | U10.2 47.44,26.85
  Top 0.762: L3.1 46.49,30.01 47.44,29.06 47.44,26.85 | 46.48,31.47 C34.1
MISO  (via drill 0.3)
  Top 0.2: U$1.18 50.18,14.54 48.47,12.83 v48.47,12.53 | U10.38 49.23,20.77 49.37,20.63 v49.37,19.43
  Bottom 0.2: v49.37,19.43 49.37,18.63 49.67,18.33 50.87,18.33 52.07,17.13 52.07,16.13 v48.47,12.53
MOSI  (via drill 0.3)
  Top 0.2: U10.36 47.84,18.26 47.97,18.13 48.67,18.13 49.47,17.33 49.47,16.43 v49.77,16.13 | U$1.17 49.68,15.04 v49.37,14.73
  Bottom 0.2: v49.77,16.13 49.77,15.13 v49.37,14.73
N$2
  Top 0.2: U$1.23 52.44,9.47 C6.1
N$3
  Top 0.2: U$1.9 54.44,17.6 54.87,18.03 56.09,18.03
  Top 0.254: 56.09,18.03 C1.1
N$4
  Top 0.254: U3.2 31.87,35.53 31.47,35.13 31.47,34.53 31.17,34.23 C26.1
N$5
  Top 0.406: U5.1 26.77,7.78 CHG1.C
N$6
  Top 0.2: U$1.10 53.94,17.7 54.87,18.63 55.57,18.63 55.77,18.83 55.77,19.53 56.56,20.32 C1.2
  Top 0.254: C1.2 56.36,20.32
N$7
  Top 0.2: U$1.11 53.44,17.8 54.93,19.29 C2.1
N$8  (via drill 0.3)
  other vias: 20.37,11.13
N$9
  Top 0.254: U4.12 69.49,30.01 71.77,27.73 R9.2
N$11
  Top 0.254: U4.11 70.13,30.47 71.57,29.03 R10.2
N$13
  Top 0.2: U$1.25 53.44,10.26 54.46,9.24 C7.1
N$14
  Top 0.254: U$1.27 54.44,11.36 56.51,9.29 C8.1
N$15
  Top 0.406: 35.22,13.18 U1.3 35.57,13.93 33.27,16.23 28.87,16.23 28.37,15.73 28.37,15.13 27.27,14.03 19.77,14.03 7.52,26.28 S1.2
N$16
  Top 0.406: CHG1.A R18.2
N$19
  Top 0.406: U5.5 20.77,7.78 R19.2
N$20  (via drill 0.3)
  Top 0.2: U6.8 44.97,16.34 41.87,13.23 v41.87,12.43
  Top 0.406: U6.8 47.23,16.34 C32.1
  Bottom 0.2: SJ1.2 41.7,12.27 v41.87,12.43
N$23
  Top 0.2: Q5.5 56.67,32.23 57.07,32.63 58.44,32.63 R29.2
N$24
  Top 0.254: Q5.2 56.67,35.46 R30.2
N$25
  Top 0.2: U10.45 49.8,23.57 50.71,24.48 Y2.1 51.82,25.92 C27.2
N$26
  Top 0.2: U10.44 50,23.17 50.37,23.53 52.16,23.53 Y2.3
  Top 0.254: Y2.3 54.37,22.13 C28.2
N$29
  Top 0.2: D9.C 40.9,7.43 R32.2
N$30
  Top 0.178: C44.2 R22.1 51.37,27.43 50.85,26.91 49.87,26.91 49.28,26.31 49.28,24.53 49.11,24.37 U10.47
OS  (via drill 0.3)
  Top 0.2: R7.2 30.01,24.07 v30.67,24.73
  Bottom 0.2: U$3.3 29.65,22.45 29.47,22.63 29.47,23.53 v30.67,24.73
RTS  (via drill 0.3)
  Top 0.254: Q5.4 54.93,31.97 54.47,32.43 v54.47,34.23 54.47,35.56 R30.1 | U4.2 65.05,28.81 v65.17,28.93
  Bottom 0.254: v54.47,34.23 62.37,34.23 65.17,31.43 v65.17,28.93
RXD
  Top 0.254: U4.4 66.32,25.58 65.17,24.43 R13.2
SCL  (via drill 0.3)
  Top 0.2: U10.39 49.43,21.17 50.07,20.53 v50.07,20.13 | R2.2 29.14,18.66 28.27,19.53 v28.27,22.13 28.27,24.93 v30.57,27.23 32.17,28.83 32.17,34.13 32.57,34.53 U3.4 | v31.97,25.73 31.97,22.43 34.37,20.03 37.07,20.03 v37.57,20.53
  Bottom 0.2: U$3.2 28.6,21.8 v28.27,22.13 | v50.07,20.13 48.87,20.13 48.17,19.43 41.07,19.43 39.77,20.73 37.77,20.73 v37.57,20.53 | v31.97,25.73 31.97,25.83 v30.57,27.23
SCLK
  Top 0.2: U10.35 47.44,17.86 47.57,17.73 48.47,17.73 49.07,17.13 49.07,15.73 49.37,15.43 50.17,15.43 50.28,15.54 U$1.16
SDA  (via drill 0.3)
  Top 0.2: U10.42 50.03,22.37 51.47,20.93 v51.87,20.93 | U3.6 33.87,29.13 32.22,27.48 | 32.22,27.48 29.07,24.33 v29.07,20.93 29.07,20.74 R1.2 | 32.22,27.48 32.77,26.93 32.77,22.53 34.57,20.73 v36.17,20.73
  Bottom 0.2: U$3.1 29.28,21.15 v29.07,20.93 | v51.87,20.93 48.97,20.93 47.97,19.93 41.37,19.93 40.07,21.23 36.67,21.23 v36.17,20.73
TRACE_ANT1
  Top 0.178: E2.ANT 44.75,38.75
  Top 0.762: 44.75,38.75 arc46 45.29,37.58 arc-35 C33.1 arc33 46.33,35.52 arc-37 46.46,35.21 46.46,34.87 C34.2
TXD
  Top 0.254: U4.20 64.41,28.52 R12.2
U0RXD  (via drill 0.3)
  Top 0.2: U10.40 49.63,21.57 51.07,20.13 v51.07,19.73 | R12.1 v59.07,25.63
  Bottom 0.2: v59.07,25.63 59.07,22.93 55.27,19.13 51.67,19.13 v51.07,19.73
U0TXD  (via drill 0.3)
  Top 0.2: U10.41 49.83,21.97 51.87,19.93 v52.07,19.93 | R13.1 58.97,24.43 v58.17,23.63
  Bottom 0.2: v52.07,19.93 54.47,19.93 v58.17,23.63
VBAT  (via drill 0.3)
  Top 0.406: Q3.3 26.17,16.23 v25.07,15.13 | U5.3 24.97,10.83 v25.07,10.93 | U5.3 26.87,9.68 C22.1 | U5.3 24.12,9.68 23.27,8.83 16.57,8.83 13.17,12.23 TP4.TP
  Bottom 0.406: v25.07,15.13 v25.07,10.93
VIN
  Top 0.406: S1.3 6.72,29.28 18.82,17.18 Q3.2 31.17,17.18 D3.C 33.52,17.28 36.67,14.13 36.67,11.58 C19.1 U1.1
VUSB  (via drill 0.3)
  Top 0.254: 75.19,25.71 74.07,26.83 71.27,26.83 v69.57,28.53 67.59,30.51 U4.15 67.59,33.56 C17.1
  Top 0.305: JP7.1 76.27,26.78 75.19,25.71 C21.1
  Top 0.406: U5.4 22.37,11.08 R20.2 C12.1 24.12,11.28 26.07,13.23 27.67,13.23 29.47,15.03 Q3.1 | Q3.1 30.97,15.28 D3.A 32.32,14.98 v32.57,15.23 | R18.1 30.92,9.88 29.77,11.03 29.77,14.98 Q3.1
  Bottom 0.406: v32.57,15.23 32.57,10.53 35.77,7.33 49.87,7.33 57.07,14.53 57.07,19.03 62.27,24.23 65.27,24.23 v69.57,28.53

### Text on the board
tPlace: LA | RST | 0 | ! | ON | RA | BATT IN / 3.7V LI-ION | + | + | - | CHG
bPlace: protocentral.com | WARNING: Do not connect USB when placed on body | Get Started: http://proty.in/hp